# EAGLE schematic blinky-leds (EAGLE 9.2.2)
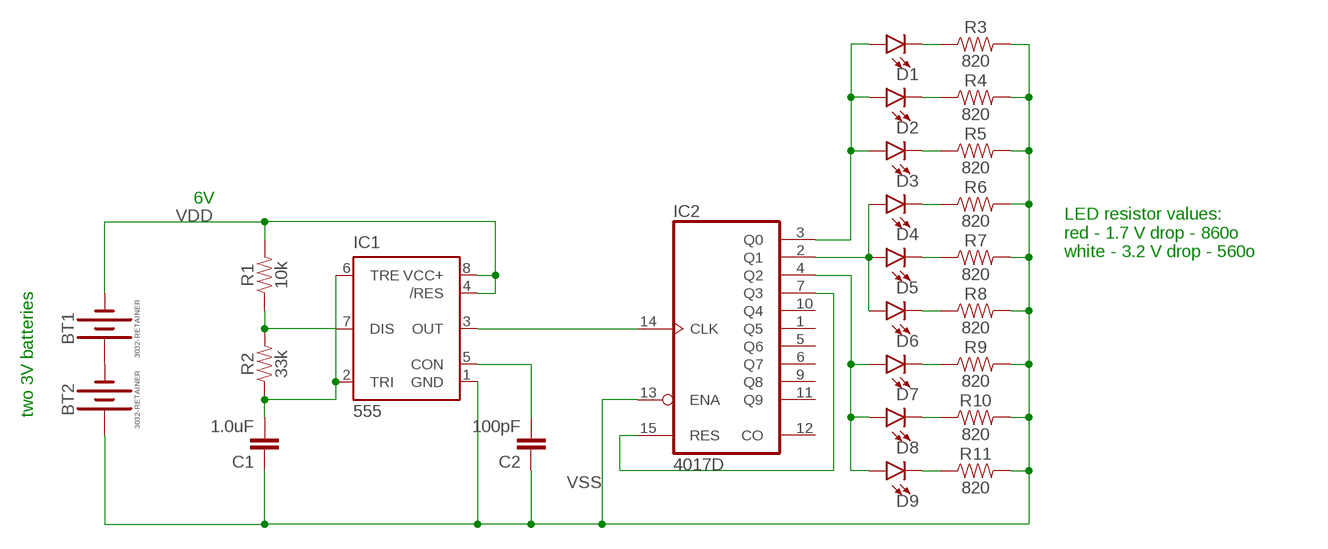
[diagram p0: schematic, sheet 1]

## Parts
BT1  3032-RETAINER  [KEYSTONE-3034]
BT2  3032-RETAINER  [KEYSTONE-3034]
C1  1.0uF  1.0UF-0603-16V-10%  [0603]
C2  100pF  100PF-0603-50V-5%  [0603]
D1  LED0603  [LED-0603]
D2  LED0603  [LED-0603]
D3  LED0603  [LED-0603]
D4  LED0603  [LED-0603]
D5  LED0603  [LED-0603]
D6  LED0603  [LED-0603]
D7  LED0603  [LED-0603]
D8  LED0603  [LED-0603]
D9  LED0603  [LED-0603]
IC1  555  555D  [SO08]
IC2  4017D  [SO16]
R1  10k  10KOHM-0603-1/10W-1%  [0603]
R2  33k  33KOHM-0603-1/10W-1%  [0603]
R3  820  RESISTOR0603  [0603]
R4  820  RESISTOR0603  [0603]
R5  820  RESISTOR0603  [0603]
R6  820  RESISTOR0603  [0603]
R7  820  RESISTOR0603  [0603]
R8  820  RESISTOR0603  [0603]
R9  820  RESISTOR0603  [0603]
R10  820  RESISTOR0603  [0603]
R11  820  RESISTOR0603  [0603]

## Nets
N$1: BT1.P$1(+) BT2.P$2(-) BT2.P$3(-)
N$2: D6.C R8.1
N$3: D1.A D2.A D3.A IC2.3(Q0)
N$4: D4.A D5.A D6.A IC2.2(Q1)
N$6: IC1.3(OUT) IC2.14(CLK)
N$7: C2.2 IC1.5(CON)
N$8: IC1.7(DIS) R1.1 R2.2
N$9: C1.2 IC1.2(TRI) IC1.6(TRE) R2.1
N$10: IC2.7(Q3) IC2.15(RES)
N$11: D5.C R7.1
N$12: D4.C R6.1
N$13: D3.C R5.1
N$14: D2.C R4.1
N$15: D1.C R3.1
N$16: D9.C R11.1
N$17: D8.C R10.1
N$18: D7.C R9.1
N$20: D7.A D8.A D9.A IC2.4(Q2)
VDD: BT1.P$2(-) BT1.P$3(-) IC1.4(/RES) IC1.8(VCC+) R1.2
VSS: BT2.P$1(+) C1.1 C2.1 IC1.1(GND) IC2.13(ENA) R3.2 R4.2 R5.2 R6.2 R7.2 R8.2 R9.2 R10.2 R11.2
Unconnected: IC2.1(Q5) IC2.5(Q6) IC2.6(Q7) IC2.9(Q8) IC2.10(Q4) IC2.11(Q9) IC2.12(CO)

## Notes on the sheet
- 6V
- LED resistor values:
  red - 1.7 V drop - 860o
  white - 3.2 V drop - 560o
- two 3V batteries

## Power pins joined to a net without a drawn wire
VDD: IC2.16(VDD)
VSS: IC2.8(VSS)

## Library data of the parts
BT1 BT2 = _noelle:3032-RETAINER
C1 = SparkFun-Capacitors:1.0UF: 1µF ceramic capacitors A capacitor is a passive two-terminal electrical component used to store electrical energy temporarily in an electric field.; PROD_ID: CAP-00868
C2 = SparkFun-Capacitors:100PF: 100pF/0.1nF ceramic capacitors A capacitor is a passive two-terminal electrical component used to store electrical energy temporarily in an electric field.; PROD_ID: CAP-07883
D1-D9 = SparkFun-LED:LED: LED (Generic) Standard schematic elements and footprints for 5mm, 3mm, 1206, and 0603 sized LEDs. Generic LEDs with no color specified.
IC1 = SparkFun-IC-Special-Function:555: General purpose bipolar Timer Datasheet <http://www.sparkfun.com/datasheets/Components/General/ne555.pdf> SparkFun Products SparkFun SparkPunk Sequencer Kit <https://www.sparkfun.com/products/12707> (KIT-12707) Storefront Component: 555 Timer <https://www.sparkfun.com/products/9273> (COM-09273) Two parts valid for production: VFP: IC-11930 (M7555 PTH) VFP: IC-09173 (555 PTH) - Preferred; PROD_ID: NA-XXXXX
IC2 = 40xx:4017: COUNTER/DIVIDER
R1 = SparkFun-Resistors:10KOHM: 10kΩ resistor A resistor is a passive two-terminal electrical component that implements electrical resistance as a circuit element. Resistors act to reduce current flow, and, at the same time, act to lower voltage levels within circuits. - Wikipedia; PROD_ID: RES-00824
R2 = SparkFun-Resistors:33KOHM: 33kΩ resistor A resistor is a passive two-terminal electrical component that implements electrical resistance as a circuit element. Resistors act to reduce current flow, and, at the same time, act to lower voltage levels within circuits. - Wikipedia; PROD_ID: RES-08416
R3-R11 = SparkFun-Resistors:RESISTOR: Generic Resistor Package